# Altium schematic sheet TOP.SchDoc: =ProjectName
size 420 x 297 mm; Author: G.K.; CompanyName: WUT; DrawnBy: P.K.; Organization: WUT ISE; Address1: Warsaw Univeristy of Technology; Address2: Nowowiejska 15/19; DocumentNumber: 1; Revision: 1.0; SheetNumber: 1; SheetTotal: 12; EDA_Number: ARTIQ; Projet: ARTIQ/SINARA; ModifiedBy: -; CreateDate: XX/XX/XXXX; CheckedDate: -; Title2: TOP.SchDoc; DivGrp: ISE; Designer: G.K. and P.K.; ModifiedDate: -; ProjectName: ARTIQ/SINARA
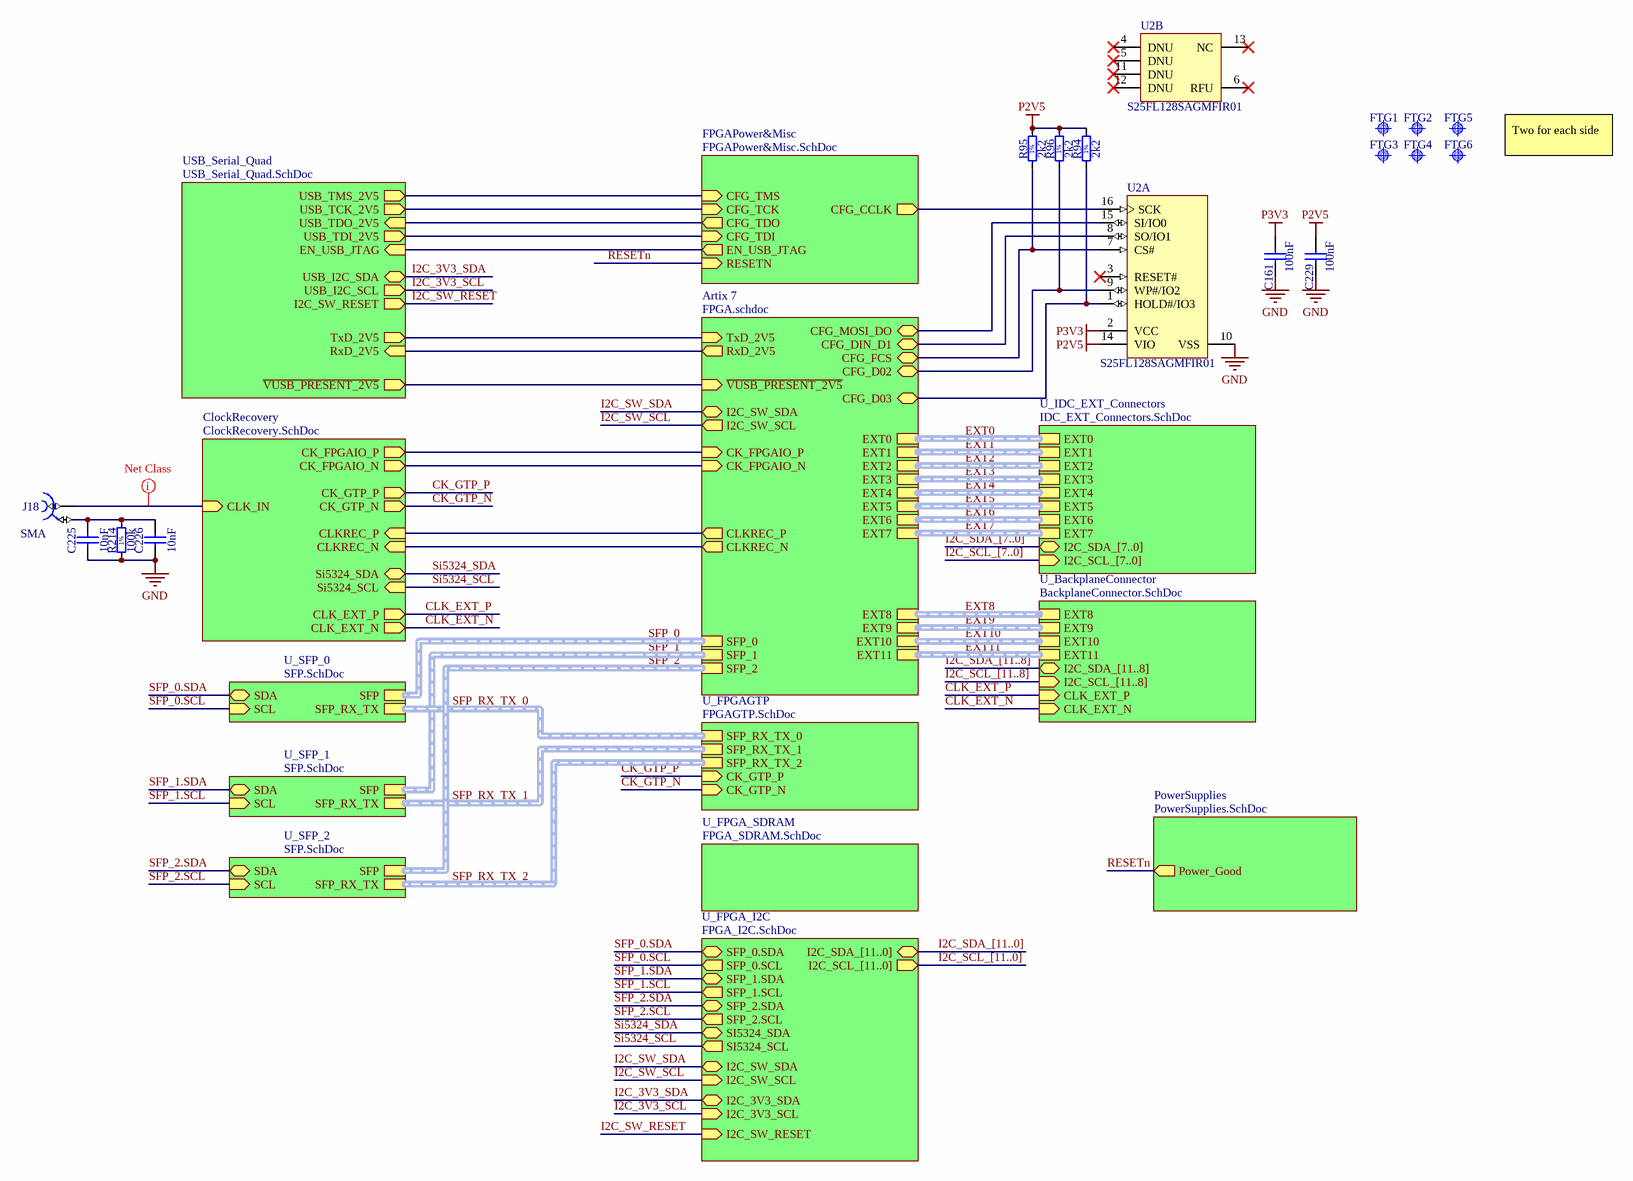
[diagram p0: TOP.SchDoc]

## Parts
C161  100nF  [CAPC0603X33N]
C225  10nF  [CAPC1005X55N]
C226  10nF  [CAPC1005X55N]
C229  100nF  [CAPC0603X33N]
FTG1  Use only in PCB  [FIDUCIAL_TOP_C100-200]  (value not drawn)
FTG2  Use only in PCB  [FIDUCIAL_TOP_S100-200]  (value not drawn)
FTG3  Use only in PCB  [FIDUCIAL_TOP_C100-200]  (value not drawn)
FTG4  Use only in PCB  [FIDUCIAL_TOP_C100-200]  (value not drawn)
FTG5  Use only in PCB  [FIDUCIAL_TOP_C100-200]  (value not drawn)
FTG6  Use only in PCB  [FIDUCIAL_TOP_S100-200]  (value not drawn)
J18  SMA  [AMPHENOL_132203]
R94  2k2  [RESC1005X40N]
R95  2k2  [RESC1005X40N]
R96  2k2  [RESC1005X40N]
R214  100k  [RESC1005X40N]
U2  S25FL128SAGMFIR01  [SPSN-SOIC-16_N]  (parts A,B of 2)

## Sub-sheets
Artix 7 = FPGA.schdoc: EXT1 (harness ExtensionConnector), EXT2 (harness ExtensionConnector), EXT0 (harness ExtensionConnector), EXT3 (harness ExtensionConnector), EXT4 (harness ExtensionConnector), EXT5 (harness ExtensionConnector), EXT6 (harness ExtensionConnector), EXT7 (harness ExtensionConnector), EXT8 (harness ExtensionConnector), EXT9 (harness ExtensionConnector), EXT10 (harness ExtensionConnector), EXT11 (harness ExtensionConnector), CLKREC_P (out), CLKREC_N (out), CK_FPGAIO_P (in), CK_FPGAIO_N (in), SFP_0 (harness SFP), SFP_2 (harness SFP), SFP_1 (harness SFP), I2C_SW_SDA (bidir), I2C_SW_SCL (out), CFG_MOSI_DO (bidir), CFG_DIN_D1 (bidir), CFG_D02 (bidir), CFG_D03 (bidir), CFG_FCS (bidir), TxD_2V5 (in), RxD_2V5 (out), ~{VUSB_PRESENT_2V5} (in)
ClockRecovery = ClockRecovery.SchDoc: CLKREC_P (in), CLKREC_N (in), Si5324_SDA (bidir), Si5324_SCL (in), CK_GTP_P (out), CK_GTP_N (out), CK_FPGAIO_P (out), CK_FPGAIO_N (out), CLK_IN (in), CLK_EXT_P (out), CLK_EXT_N (out)
FPGAPower&Misc = FPGAPower&Misc.SchDoc: RESETN (in), CFG_CCLK (out), CFG_TMS (in), CFG_TCK (in), CFG_TDO (out), CFG_TDI (in), EN_USB_JTAG (out)
PowerSupplies = PowerSupplies.SchDoc: Power_Good (out)
U_BackplaneConnector = BackplaneConnector.SchDoc: EXT8 (harness ExtensionConnector), EXT9 (harness ExtensionConnector), EXT10 (harness ExtensionConnector), EXT11 (harness ExtensionConnector), I2C_SDA_[11..8] (bidir), I2C_SCL_[11..8] (in), CLK_EXT_P (in), CLK_EXT_N (in)
U_FPGA_I2C = FPGA_I2C.SchDoc: I2C_SDA_[11..0] (bidir), SFP_2.SDA (bidir), SFP_1.SDA (bidir), SFP_0.SDA (bidir), I2C_SW_SDA (bidir), I2C_SCL_[11..0] (out), SFP_0.SCL (out), SFP_1.SCL (out), SFP_2.SCL (out), SI5324_SDA (bidir), SI5324_SCL (out), I2C_SW_SCL (in), I2C_3V3_SCL (in), I2C_3V3_SDA (bidir), I2C_SW_RESET (in)
U_FPGA_SDRAM = FPGA_SDRAM.SchDoc: no entries
U_FPGAGTP = FPGAGTP.SchDoc: SFP_RX_TX_0 (harness SFP_RX_TX), SFP_RX_TX_1 (harness SFP_RX_TX), SFP_RX_TX_2 (harness SFP_RX_TX), CK_GTP_P (in), CK_GTP_N (in)
U_IDC_EXT_Connectors = IDC_EXT_Connectors.SchDoc: I2C_SDA_[7..0] (bidir), I2C_SCL_[7..0] (in), EXT0 (harness ExtensionConnector), EXT4 (harness ExtensionConnector), EXT2 (harness ExtensionConnector), EXT1 (harness ExtensionConnector), EXT3 (harness ExtensionConnector), EXT7 (harness ExtensionConnector), EXT6 (harness ExtensionConnector), EXT5 (harness ExtensionConnector)
U_SFP_0 = SFP.SchDoc: SDA (bidir), SCL (in), SFP (harness SFP), SFP_RX_TX (harness SFP_RX_TX)
U_SFP_1 = SFP.SchDoc: SDA (bidir), SCL (in), SFP (harness SFP), SFP_RX_TX (harness SFP_RX_TX)
U_SFP_2 = SFP.SchDoc: SDA (bidir), SCL (in), SFP (harness SFP), SFP_RX_TX (harness SFP_RX_TX)
USB_Serial_Quad = USB_Serial_Quad.SchDoc: USB_TDO_2V5 (in), RxD_2V5 (in), USB_TMS_2V5 (out), USB_TDI_2V5 (out), USB_TCK_2V5 (out), TxD_2V5 (out), EN_USB_JTAG (in), USB_I2C_SCL (out), USB_I2C_SDA (bidir), ~{VUSB_PRESENT_2V5} (out), I2C_SW_RESET (out)

## Nets
GND: C161.1 C225.1 C226.1 C229.1 R214.1 U2.10(VSS)
P2V5: C229.2 R94.2 R95.2 R96.2 U2.14(VIO)
P3V3: C161.2 U2.2(VCC)
CK_GTP_N: sheet ClockRecovery/CK_GTP_N, sheet U_FPGAGTP/CK_GTP_N
CK_GTP_P: sheet ClockRecovery/CK_GTP_P, sheet U_FPGAGTP/CK_GTP_P
CLK_EXT_N: sheet ClockRecovery/CLK_EXT_N, sheet U_BackplaneConnector/CLK_EXT_N
CLK_EXT_P: sheet ClockRecovery/CLK_EXT_P, sheet U_BackplaneConnector/CLK_EXT_P
I2C_3V3_SCL: sheet U_FPGA_I2C/I2C_3V3_SCL, sheet USB_Serial_Quad/USB_I2C_SCL
I2C_3V3_SDA: sheet U_FPGA_I2C/I2C_3V3_SDA, sheet USB_Serial_Quad/USB_I2C_SDA
I2C_SW_RESET: sheet U_FPGA_I2C/I2C_SW_RESET, sheet USB_Serial_Quad/I2C_SW_RESET
I2C_SW_SCL: sheet Artix 7/I2C_SW_SCL, sheet U_FPGA_I2C/I2C_SW_SCL
I2C_SW_SDA: sheet Artix 7/I2C_SW_SDA, sheet U_FPGA_I2C/I2C_SW_SDA
RESETn: sheet PowerSupplies/Power_Good, sheet FPGAPower&Misc/RESETN
SFP_0.SCL: sheet U_SFP_0/SCL, sheet U_FPGA_I2C/SFP_0.SCL
SFP_0.SDA: sheet U_SFP_0/SDA, sheet U_FPGA_I2C/SFP_0.SDA
SFP_1.SCL: sheet U_SFP_1/SCL, sheet U_FPGA_I2C/SFP_1.SCL
SFP_1.SDA: sheet U_SFP_1/SDA, sheet U_FPGA_I2C/SFP_1.SDA
SFP_2.SCL: sheet U_SFP_2/SCL, sheet U_FPGA_I2C/SFP_2.SCL
SFP_2.SDA: sheet U_SFP_2/SDA, sheet U_FPGA_I2C/SFP_2.SDA
Si5324_SCL: sheet ClockRecovery/Si5324_SCL, sheet U_FPGA_I2C/SI5324_SCL
Si5324_SDA: sheet ClockRecovery/Si5324_SDA, sheet U_FPGA_I2C/SI5324_SDA
NetC225_2: C225.2 C226.2 J18.2 R214.2
NetJ18_1: J18.1 ; sheet ClockRecovery/CLK_IN
NetR94_1: R94.1 U2.1(HOLD#/IO3) ; sheet Artix 7/CFG_D03
NetR95_1: R95.1 U2.7(CS#) ; sheet Artix 7/CFG_FCS
NetR96_1: R96.1 U2.9(WP#/IO2) ; sheet Artix 7/CFG_D02
NetU2_8: U2.8(SO/IO1) ; sheet Artix 7/CFG_DIN_D1
NetU2_15: U2.15(SI/IO0) ; sheet Artix 7/CFG_MOSI_DO
NetU2_16: U2.16(SCK) ; sheet FPGAPower&Misc/CFG_CCLK
(unnamed): sheet Artix 7/CLKREC_P, sheet ClockRecovery/CLKREC_P
(unnamed): sheet Artix 7/CLKREC_N, sheet ClockRecovery/CLKREC_N
(unnamed): sheet Artix 7/CK_FPGAIO_P, sheet ClockRecovery/CK_FPGAIO_P
(unnamed): sheet Artix 7/CK_FPGAIO_N, sheet ClockRecovery/CK_FPGAIO_N
(unnamed): sheet Artix 7/TxD_2V5, sheet USB_Serial_Quad/TxD_2V5
(unnamed): sheet Artix 7/RxD_2V5, sheet USB_Serial_Quad/RxD_2V5
(unnamed): sheet Artix 7/~{VUSB_PRESENT_2V5}, sheet USB_Serial_Quad/~{VUSB_PRESENT_2V5}
(unnamed): sheet FPGAPower&Misc/CFG_TMS, sheet USB_Serial_Quad/USB_TMS_2V5
(unnamed): sheet FPGAPower&Misc/CFG_TCK, sheet USB_Serial_Quad/USB_TCK_2V5
(unnamed): sheet FPGAPower&Misc/CFG_TDO, sheet USB_Serial_Quad/USB_TDO_2V5
(unnamed): sheet FPGAPower&Misc/CFG_TDI, sheet USB_Serial_Quad/USB_TDI_2V5
(unnamed): sheet FPGAPower&Misc/EN_USB_JTAG, sheet USB_Serial_Quad/EN_USB_JTAG

Not connected (* = marked no-connect by the designer): U2 3(RESET#)* 4(DNU)* 5(DNU)* 6(RFU)* 11(DNU)* 12(DNU)* 13(NC)*

## Buses and harness runs
bus I2C_SCL_[7..0] = sheet U_IDC_EXT_Connectors/I2C_SCL_[7..0]
bus I2C_SCL_[11..0] = sheet U_FPGA_I2C/I2C_SCL_[11..0]
bus I2C_SCL_[11..8] = sheet U_BackplaneConnector/I2C_SCL_[11..8]
bus I2C_SDA_[7..0] = sheet U_IDC_EXT_Connectors/I2C_SDA_[7..0]
bus I2C_SDA_[11..0] = sheet U_FPGA_I2C/I2C_SDA_[11..0]
bus I2C_SDA_[11..8] = sheet U_BackplaneConnector/I2C_SDA_[11..8]
harness EXT0 = sheet Artix 7/EXT0 = sheet U_IDC_EXT_Connectors/EXT0
harness EXT1 = sheet Artix 7/EXT1 = sheet U_IDC_EXT_Connectors/EXT1
harness EXT2 = sheet Artix 7/EXT2 = sheet U_IDC_EXT_Connectors/EXT2
harness EXT3 = sheet Artix 7/EXT3 = sheet U_IDC_EXT_Connectors/EXT3
harness EXT4 = sheet Artix 7/EXT4 = sheet U_IDC_EXT_Connectors/EXT4
harness EXT5 = sheet Artix 7/EXT5 = sheet U_IDC_EXT_Connectors/EXT5
harness EXT6 = sheet Artix 7/EXT6 = sheet U_IDC_EXT_Connectors/EXT6
harness EXT7 = sheet Artix 7/EXT7 = sheet U_IDC_EXT_Connectors/EXT7
harness EXT8 = sheet Artix 7/EXT8 = sheet U_BackplaneConnector/EXT8
harness EXT9 = sheet Artix 7/EXT9 = sheet U_BackplaneConnector/EXT9
harness EXT10 = sheet Artix 7/EXT10 = sheet U_BackplaneConnector/EXT10
harness EXT11 = sheet Artix 7/EXT11 = sheet U_BackplaneConnector/EXT11
harness SFP_0 = sheet Artix 7/SFP_0 = sheet U_SFP_0/SFP
harness SFP_1 = sheet Artix 7/SFP_1 = sheet U_SFP_1/SFP
harness SFP_2 = sheet Artix 7/SFP_2 = sheet U_SFP_2/SFP
harness SFP_RX_TX_0 = sheet U_FPGAGTP/SFP_RX_TX_0 = sheet U_SFP_0/SFP_RX_TX
harness SFP_RX_TX_1 = sheet U_FPGAGTP/SFP_RX_TX_1 = sheet U_SFP_1/SFP_RX_TX
harness SFP_RX_TX_2 = sheet U_FPGAGTP/SFP_RX_TX_2 = sheet U_SFP_2/SFP_RX_TX

## Layout directives
net class 50Ohm: NetJ18_1

## Notes on the sheet
- Two for each side
- Project/Equipment
- Document
- Designer
- Drawn by
- Check.by
- File
- Last Mod.
- Print Date
- Sheet
- Size
- A3
- of
- Rev
- (in symbol R0402_2K2_1%_0.0625W_100PPM) 1%
- (in symbol R0402_100K_1%_0.0625W_100PPM) 1%

## Library data of the parts
C161 C229 = CC0201_100NF_6.3V_10%_X5R: Non-polarised capacitor; Part Description: SMD Multilayer Chip Ceramic Capacitor; Manufacturer: GENERIC; Manufacturer1 Part Number: 02016D104KAT2A; Voltage: 6.3V; TC: X5R; Tolerance: ±10%; Part Number: CC0201_100NF_6.3V_10%_X5R; Component Kind: Standard; Component Type: Standard; Pin Count: 2; Value: 100nF; Status: Not Recommended; Manufacturer Part Number: CC0201_100NF_6.3V_10%_X5R; Case: 0201; Mounted: Yes; Socket: No; SMD: Yes; Sense: No; Manufacturer1 Example: AVX; Manufacturer1 ComponentHeight: 0.33mm; HelpURL: \\cern.ch\dfs\Applications\Altium\Datasheets\CC0201_X5R_AVX.pdf; Author: CERN DEM JLC; CreateDate: 03.12.2007; LatestRevisionDate: 03.12.2007; ClassName: Artix
C225 C226 = CC0402_10NF_16V_10%_X7R: Non-polarised capacitor; Part Description: SMD Multilayer Chip Ceramic Capacitor; Manufacturer: GENERIC; Manufacturer1 Part Number: 223878715636; Voltage: 16V; TC: X7R; Tolerance: ±10%; Part Number: CC0402_10NF_16V_10%_X7R; Component Kind: Standard; Component Type: Standard; Pin Count: 2; Value: 10nF; Status: Not Recommended; Manufacturer Part Number: CC0402_10NF_16V_10%_X7R; Case: 0402; Mounted: Yes; Socket: No; SMD: Yes; Sense: No; Manufacturer1 Example: PHYCOMP; Manufacturer1 ComponentHeight: 0.55mm; HelpURL: \\cern.ch\dfs\Applications\Altium\Datasheets\CC0402_X7R_PHYCOMP.pdf; Author: CERN DEM JLC; CreateDate: 03.12.2007; LatestRevisionDate: 03.12.2007
FTG1 FTG3-FTG5 = FIDUCIAL_TARGET_C100-200: Fiducial Target; Part Description: Round Fiducial Target, Top Layer, 1.0mm, Top Solder 2.0mm, Keepout =2.0mm; Mounted: No; Part Number: FIDUCIAL_TARGET_C100-200; Component Kind: Standard (No BOM); Component Type: Standard (No BOM); Pin Count: 1; Family: Fiducial; Socket: No; SMD: Yes; Sense: No; Status: None; ComponentHeight: 0mm; HelpURL: Undefined; Author: CERN DEM JLC; CreateDate: 09.02.2010; LatestRevisionDate: 04.04.2012; PackageDescription: Round Fiducial Target, Top Layer, 1.0mm, Top Solder 2.0mm, Keepout =2.0mm
FTG2 FTG6 = FIDUCIAL_TARGET_S100-200: Fiducial Target; Part Description: Square Fiducial Target, Top Layer, 1.0mm, Top Solder 2.0mm, Keepout =2.0mm; Mounted: No; Part Number: FIDUCIAL_TARGET_S100-200; Component Kind: Standard (No BOM); Component Type: Standard (No BOM); Pin Count: 1; Family: Fiducial; Socket: No; SMD: Yes; Sense: No; Status: None; ComponentHeight: 0mm; HelpURL: Undefined; Author: CERN DEM JLC; CreateDate: 09.02.2010; LatestRevisionDate: 04.04.2012; PackageDescription: Square Fiducial Target, Top Layer, 1.0mm, Top Solder 2.0mm, Keepout =2.0mm
J18 = AMPHENOL_132203: Part Description: 50 Ohm Through Hole SMA Right Angle PCB Jack; Manufacturer Part Number: 132203; PressFit: No; Part Number: AMPHENOL_132203; Component Kind: Standard; Component Type: Standard; Pin Count: 5; Family: SMA; Mounted: Yes; Socket: No; SMD: No; Sense: No; Status: None; Manufacturer: AMPHENOL; ComponentHeight: 10.44mm; HelpURL: \\cern.ch\dfs\Applications\Altium\Datasheets\AMPHENOL_132203.pdf; Author: CERN DEM MR; CreateDate: 2016-10-06; LatestRevisionDate: 2016-10-06; ClassName: Connectors
R94-R96 = R0402_2K2_1%_0.0625W_100PPM: Resistor - 1%; Part Description: General Purpose Thick Film Chip Resistor; Manufacturer: GENERIC; Manufacturer1 Part Number: 232270672202L; TC: ±100ppm/°C; PressFit: No; Part Number: R0402_2K2_1%_0.0625W_100PPM; Component Kind: Standard; Component Type: Standard; Pin Count: 2; Value: 2k2; Status: Not Recommended; Power: 0.0625W; Tolerance: ±1%; Manufacturer Part Number: R0402_2K2_1%_0.0625W_100PPM; Case: 0402; Mounted: Yes; Sense: No; Socket: No; SMD: Yes; Manufacturer1 Example: YAGEO PHYCOMP; Manufacturer1 ComponentHeight: 0.4mm; HelpURL: \\cern.ch\dfs\Applications\Altium\Datasheets\R0402_Phycomp_RC0402.pdf; Author: CERN DEM JLC; CreateDate: 03.12.2007; LatestRevisionDate: 17.10.2012; ClassName: Artix
R214 = R0402_100K_1%_0.0625W_100PPM: Resistor - 1%; Part Description: General Purpose Thick Film Chip Resistor; Manufacturer: GENERIC; Manufacturer1 Part Number: 232270671004L; PressFit: No; TC: ±100ppm/°C; Part Number: R0402_100K_1%_0.0625W_100PPM; Component Kind: Standard; Component Type: Standard; Pin Count: 2; Value: 100k; Status: Not Recommended; Manufacturer Part Number: R0402_100K_1%_0.0625W_100PPM; Case: 0402; Mounted: Yes; Sense: No; Socket: No; SMD: Yes; Manufacturer1 Example: YAGEO PHYCOMP; Manufacturer1 ComponentHeight: 0.4mm; HelpURL: \\cern.ch\dfs\Applications\Altium\Datasheets\R0402_Phycomp_RC0402.pdf; Author: CERN DEM JLC; CreateDate: 03.12.2007; LatestRevisionDate: 17.10.2012; Power: 0.0625W; Tolerance: ±1%
U2 = CMP-1329-00021-1: MirrorBit Flash Non-Volatile Memory CMOS 3.0 Volt Core with Versatile I/O, Serial Peripheral Interface with Multi-I/O, 128 Mbit, 133 MHz, -40 to 85 degC, 16-Pin SO (SO3016), RoHS, Tube; Manufacturer: Spansion; OTP: 1024 B; VCC: 2.7 to 3.6 V; Speed: 133 MHz; PackageDescription: 16-Pin Wide Plastic Small Outline Package, Body 10.3 x 7.5 mm, Pitch 1.27 mm; ComponentLink2URL: http://www.spansion.com/Support/Datasheets/S25FL128S_256S_00.pdf; PartNumber: S25FL128SAGMFIR01; Packing: Tube; Density: 128 Mbit; Temperature Range: -40 to 85 degC; Mounting Technology: Surface Mount; RoHS: TRUE; DatasheetVersion: Rev. 08; ComponentLink2Description: Datasheet; ComponentLink3URL: http://www.spansion.com/Support/Datasheets/S25FL128S_256S_00.pdf; ComponentLink1Description: Manufacturer URL; ComponentLink1URL: http://www.spansion.com/Pages/Default.aspx; ComponentLink3Description: Package Specification